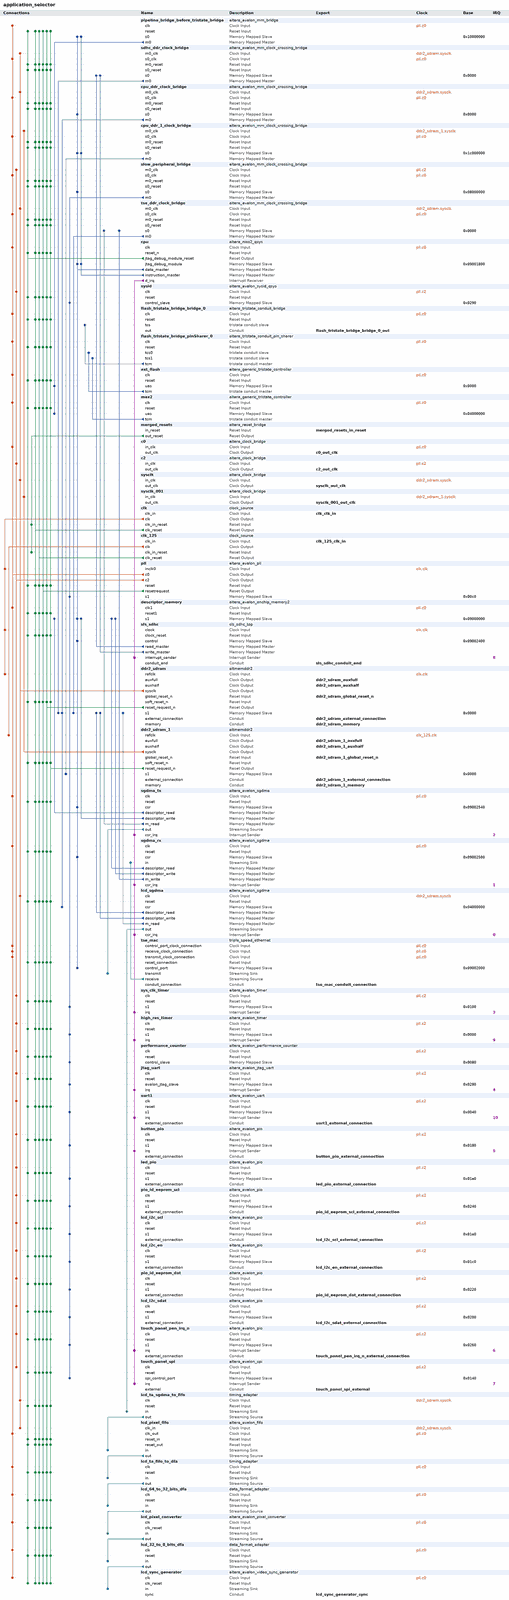
[diagram p0: system contents, whole]
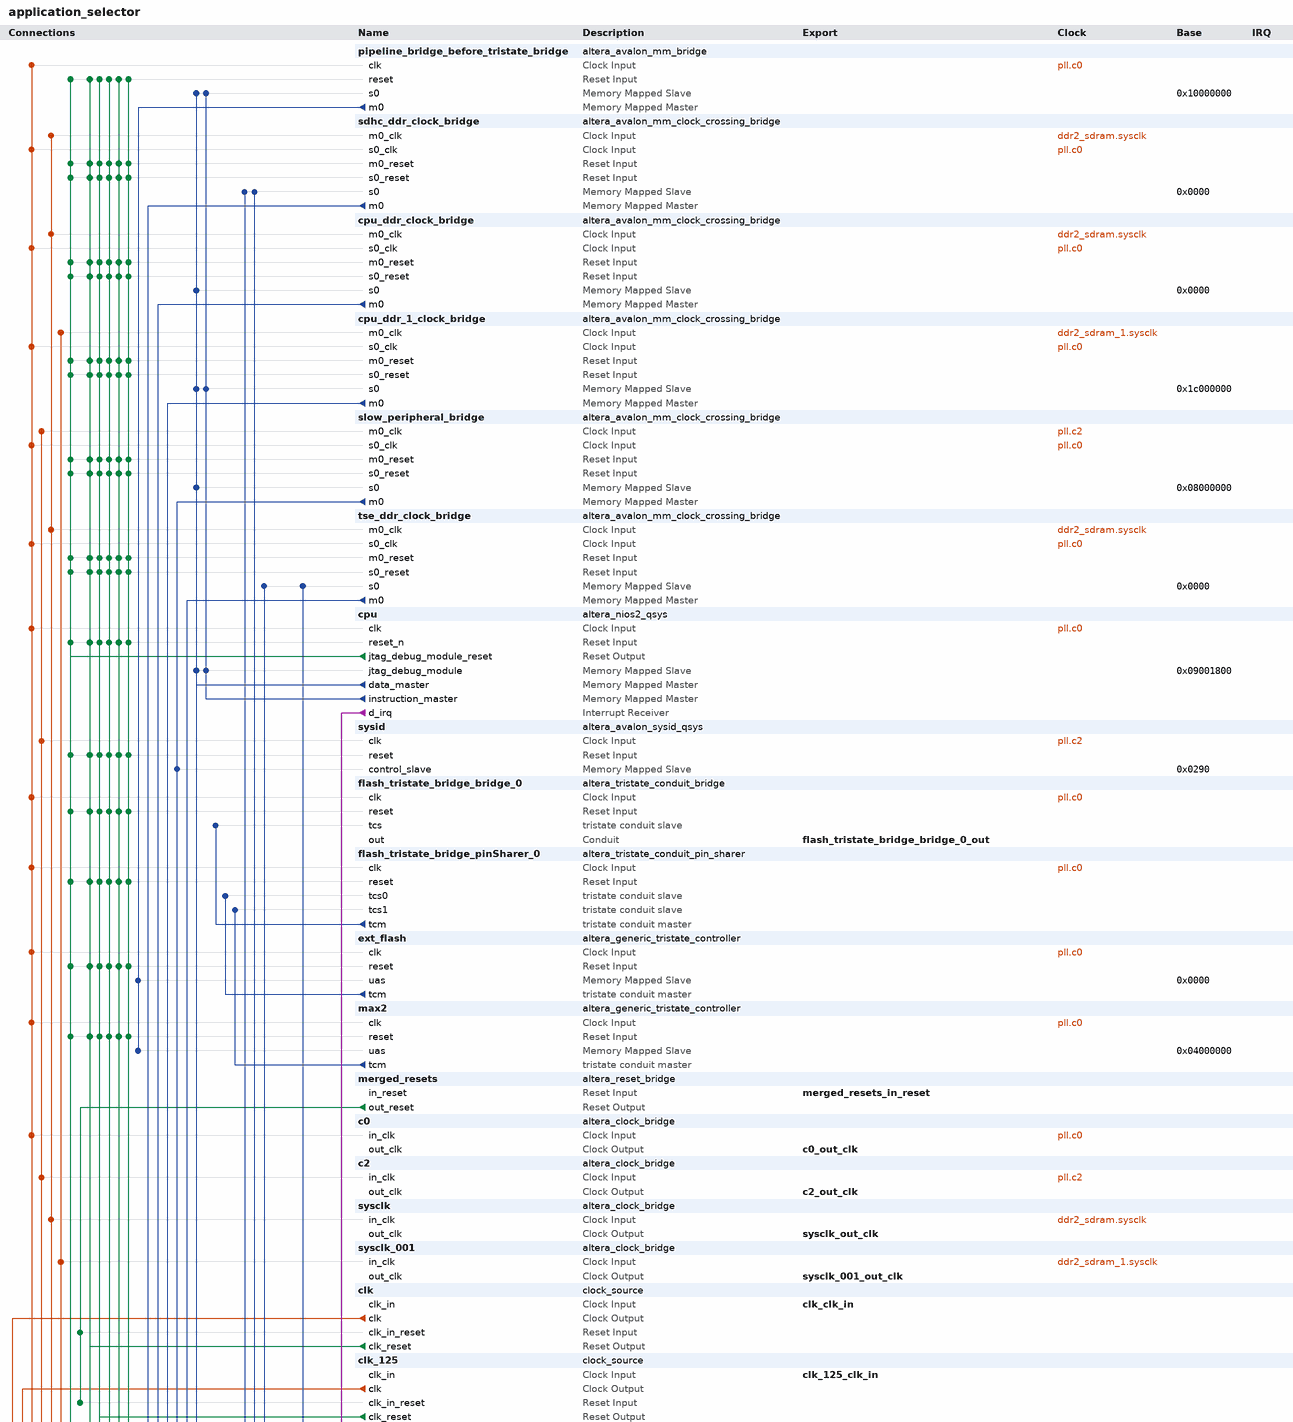
[diagram p1: system contents, upper part]
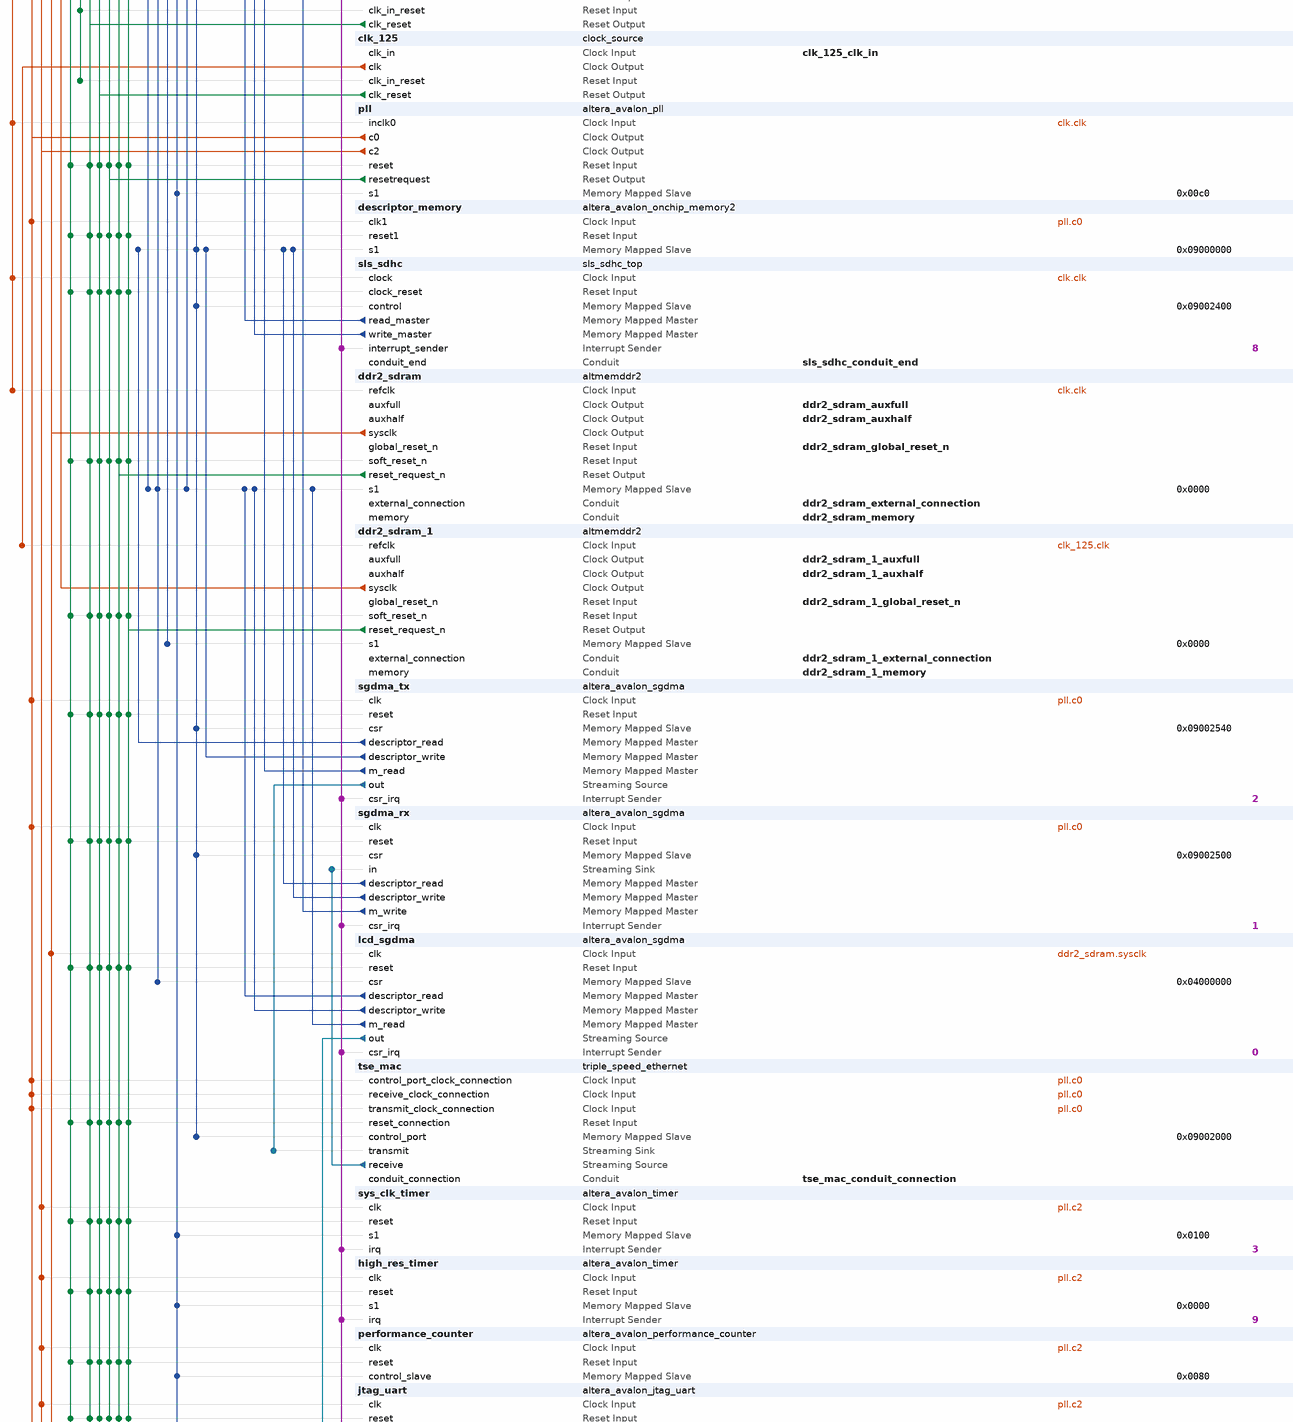
[diagram p2: system contents, middle part]
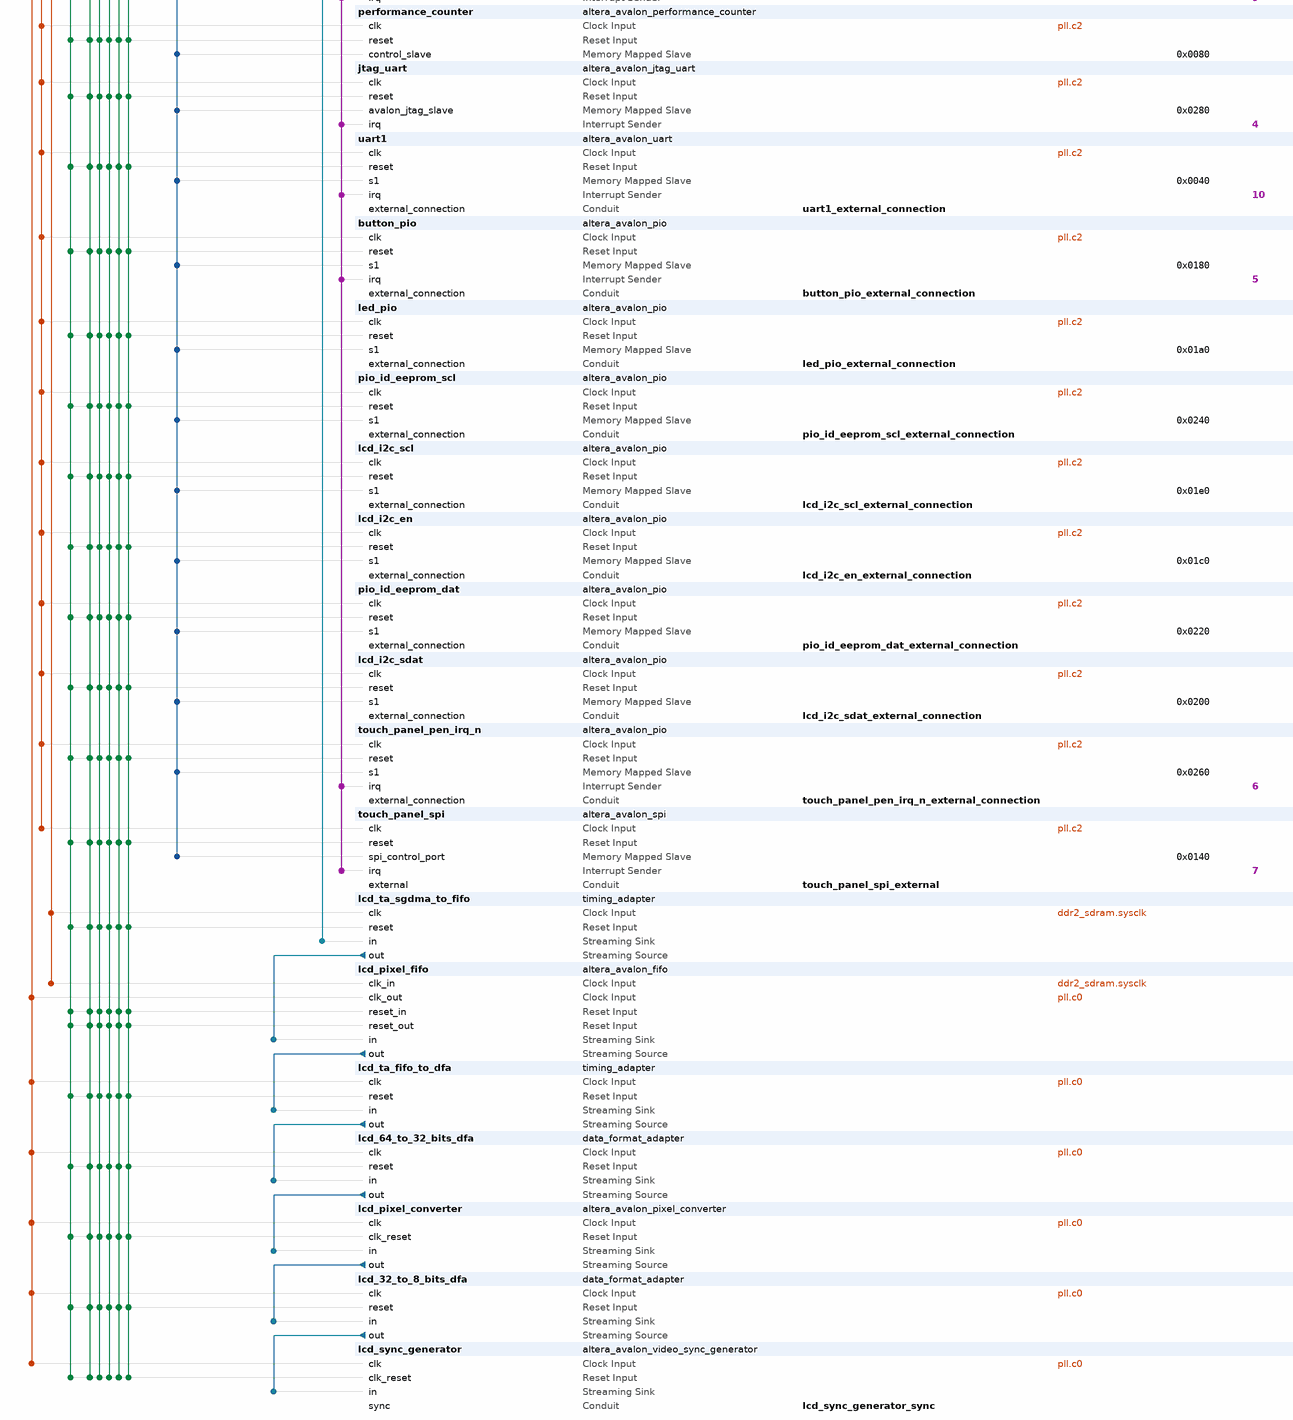
[diagram p3: system contents, lower part]
# Platform Designer (Qsys) system application_selector
# Parameters at their usual value, and those the tool derives, are not listed.
package require -exact qsys 11.0
create_system application_selector
set_project_property DEVICE_FAMILY CYCLONEIII

add_instance pipeline_bridge_before_tristate_bridge altera_avalon_mm_bridge 11.0
set_instance_parameter_value pipeline_bridge_before_tristate_bridge DATA_WIDTH 32
set_instance_parameter_value pipeline_bridge_before_tristate_bridge ADDRESS_WIDTH 27
set_instance_parameter_value pipeline_bridge_before_tristate_bridge ADDRESS_UNITS SYMBOLS
set_instance_parameter_value pipeline_bridge_before_tristate_bridge MAX_PENDING_RESPONSES 5

add_instance sdhc_ddr_clock_bridge altera_avalon_mm_clock_crossing_bridge 11.0
set_instance_parameter_value sdhc_ddr_clock_bridge DATA_WIDTH 64
set_instance_parameter_value sdhc_ddr_clock_bridge ADDRESS_WIDTH 26
set_instance_parameter_value sdhc_ddr_clock_bridge MAX_BURST_SIZE 1
set_instance_parameter_value sdhc_ddr_clock_bridge COMMAND_FIFO_DEPTH 8
set_instance_parameter_value sdhc_ddr_clock_bridge RESPONSE_FIFO_DEPTH 64
set_instance_parameter_value sdhc_ddr_clock_bridge MASTER_SYNC_DEPTH 3
set_instance_parameter_value sdhc_ddr_clock_bridge SLAVE_SYNC_DEPTH 3

add_instance cpu_ddr_clock_bridge altera_avalon_mm_clock_crossing_bridge 11.0
set_instance_parameter_value cpu_ddr_clock_bridge DATA_WIDTH 32
set_instance_parameter_value cpu_ddr_clock_bridge ADDRESS_WIDTH 27
set_instance_parameter_value cpu_ddr_clock_bridge MAX_BURST_SIZE 1
set_instance_parameter_value cpu_ddr_clock_bridge COMMAND_FIFO_DEPTH 8
set_instance_parameter_value cpu_ddr_clock_bridge RESPONSE_FIFO_DEPTH 64
set_instance_parameter_value cpu_ddr_clock_bridge MASTER_SYNC_DEPTH 3
set_instance_parameter_value cpu_ddr_clock_bridge SLAVE_SYNC_DEPTH 3

add_instance cpu_ddr_1_clock_bridge altera_avalon_mm_clock_crossing_bridge 11.0
set_instance_parameter_value cpu_ddr_1_clock_bridge DATA_WIDTH 32
set_instance_parameter_value cpu_ddr_1_clock_bridge ADDRESS_WIDTH 26
set_instance_parameter_value cpu_ddr_1_clock_bridge MAX_BURST_SIZE 1
set_instance_parameter_value cpu_ddr_1_clock_bridge COMMAND_FIFO_DEPTH 8
set_instance_parameter_value cpu_ddr_1_clock_bridge RESPONSE_FIFO_DEPTH 64
set_instance_parameter_value cpu_ddr_1_clock_bridge MASTER_SYNC_DEPTH 3
set_instance_parameter_value cpu_ddr_1_clock_bridge SLAVE_SYNC_DEPTH 3

add_instance slow_peripheral_bridge altera_avalon_mm_clock_crossing_bridge 11.0
set_instance_parameter_value slow_peripheral_bridge DATA_WIDTH 32
set_instance_parameter_value slow_peripheral_bridge ADDRESS_WIDTH 10
set_instance_parameter_value slow_peripheral_bridge MAX_BURST_SIZE 1
set_instance_parameter_value slow_peripheral_bridge COMMAND_FIFO_DEPTH 16
set_instance_parameter_value slow_peripheral_bridge RESPONSE_FIFO_DEPTH 64
set_instance_parameter_value slow_peripheral_bridge MASTER_SYNC_DEPTH 3
set_instance_parameter_value slow_peripheral_bridge SLAVE_SYNC_DEPTH 3

add_instance tse_ddr_clock_bridge altera_avalon_mm_clock_crossing_bridge 11.0
set_instance_parameter_value tse_ddr_clock_bridge DATA_WIDTH 32
set_instance_parameter_value tse_ddr_clock_bridge ADDRESS_WIDTH 26
set_instance_parameter_value tse_ddr_clock_bridge MAX_BURST_SIZE 1
set_instance_parameter_value tse_ddr_clock_bridge COMMAND_FIFO_DEPTH 8
set_instance_parameter_value tse_ddr_clock_bridge RESPONSE_FIFO_DEPTH 64
set_instance_parameter_value tse_ddr_clock_bridge MASTER_SYNC_DEPTH 3
set_instance_parameter_value tse_ddr_clock_bridge SLAVE_SYNC_DEPTH 3

add_instance cpu altera_nios2_qsys 11.0
set_instance_parameter_value cpu manuallyAssignCpuID false
set_instance_parameter_value cpu resetOffset 1048576
set_instance_parameter_value cpu exceptionOffset 64
set_instance_parameter_value cpu resetSlave ext_flash.uas
set_instance_parameter_value cpu exceptionSlave ddr2_sdram_1.s1
set_instance_parameter_value cpu breakSlave cpu.jtag_debug_module
set_instance_parameter_value cpu impl Fast
set_instance_parameter_value cpu icache_size 32768
set_instance_parameter_value cpu dcache_size 32768

add_instance sysid altera_avalon_sysid_qsys 11.0
set_instance_parameter_value sysid id 0

add_instance flash_tristate_bridge_bridge_0 altera_tristate_conduit_bridge 11.0

add_instance flash_tristate_bridge_pinSharer_0 altera_tristate_conduit_pin_sharer 11.0
set_instance_parameter_value flash_tristate_bridge_pinSharer_0 NUM_INTERFACES 2
set_instance_parameter_value flash_tristate_bridge_pinSharer_0 MODULE_ORIGIN_LIST max2.tcm,max2.tcm,max2.tcm,max2.tcm,max2.tcm,ext_flash.tcm,ext_flash.tcm,ext_flash.tcm,ext_flash.tcm,ext_flash.tcm
set_instance_parameter_value flash_tristate_bridge_pinSharer_0 SIGNAL_ORIGIN_LIST address,read_n,write_n,data,chipselect_n,address,read_n,write_n,data,chipselect_n
set_instance_parameter_value flash_tristate_bridge_pinSharer_0 SHARED_SIGNAL_LIST flash_tristate_bridge_address,oe_n_to_the_max2,we_n_to_the_max2,flash_tristate_bridge_data,cs_n_to_the_max2,flash_tristate_bridge_address,read_n_to_the_ext_flash,write_n_to_the_ext_flash,flash_tristate_bridge_data,select_n_to_the_ext_flash

add_instance ext_flash altera_generic_tristate_controller 11.0
set_instance_parameter_value ext_flash TCM_ADDRESS_W 26
set_instance_parameter_value ext_flash TCM_DATA_W 16
set_instance_parameter_value ext_flash TCM_BYTEENABLE_W 2
set_instance_parameter_value ext_flash TCM_READ_WAIT 40
set_instance_parameter_value ext_flash TCM_WRITE_WAIT 40
set_instance_parameter_value ext_flash TCM_SETUP_WAIT 80
set_instance_parameter_value ext_flash TCM_DATA_HOLD 20
set_instance_parameter_value ext_flash TCM_MAX_PENDING_READ_TRANSACTIONS 3
set_instance_parameter_value ext_flash TCM_TURNAROUND_TIME 2
set_instance_parameter_value ext_flash TCM_TIMING_UNITS 0
set_instance_parameter_value ext_flash TCM_READLATENCY 2
set_instance_parameter_value ext_flash TCM_SYMBOLS_PER_WORD 2
set_instance_parameter_value ext_flash USE_READ 1
set_instance_parameter_value ext_flash USE_BEGINTRANSFER 0
set_instance_parameter_value ext_flash USE_BYTEENABLE 0
set_instance_parameter_value ext_flash USE_OUTPUTENABLE 0
set_instance_parameter_value ext_flash ACTIVE_LOW_READ 1
set_instance_parameter_value ext_flash ACTIVE_LOW_BYTEENABLE 0
set_instance_parameter_value ext_flash ACTIVE_LOW_OUTPUTENABLE 0
set_instance_parameter_value ext_flash ACTIVE_LOW_BEGINTRANSFER 0
set_instance_parameter_value ext_flash CHIPSELECT_THROUGH_READLATENCY 0
set_instance_parameter_value ext_flash MODULE_ASSIGNMENT_KEYS embeddedsw.configuration.hwClassnameDriverSupportList,embeddedsw.configuration.hwClassnameDriverSupportDefault,embeddedsw.CMacro.SETUP_VALUE,embeddedsw.CMacro.WAIT_VALUE,embeddedsw.CMacro.HOLD_VALUE,embeddedsw.CMacro.TIMING_UNITS,embeddedsw.CMacro.SIZE,embeddedsw.memoryInfo.MEM_INIT_DATA_WIDTH,embeddedsw.memoryInfo.HAS_BYTE_LANE,embeddedsw.memoryInfo.IS_FLASH,embeddedsw.memoryInfo.GENERATE_DAT_SYM,embeddedsw.memoryInfo.GENERATE_FLASH,embeddedsw.memoryInfo.DAT_SYM_INSTALL_DIR,embeddedsw.memoryInfo.FLASH_INSTALL_DIR
set_instance_parameter_value ext_flash MODULE_ASSIGNMENT_VALUES {altera_avalon_lan91c111:altera_avalon_cfi_flash,altera_avalon_cfi_flash,80,40,20,"ns",67108864u,16,1,1,1,1,SIM_DIR,APP_DIR}
set_instance_parameter_value ext_flash INTERFACE_ASSIGNMENT_KEYS embeddedsw.configuration.isFlash,embeddedsw.configuration.isMemoryDevice,embeddedsw.configuration.isNonVolatileStorage
set_instance_parameter_value ext_flash INTERFACE_ASSIGNMENT_VALUES 1,1,1

add_instance max2 altera_generic_tristate_controller 11.0
set_instance_parameter_value max2 TCM_ADDRESS_W 5
set_instance_parameter_value max2 TCM_DATA_W 32
set_instance_parameter_value max2 TCM_BYTEENABLE_W 4
set_instance_parameter_value max2 TCM_READ_WAIT 100
set_instance_parameter_value max2 TCM_WRITE_WAIT 100
set_instance_parameter_value max2 TCM_SETUP_WAIT 0
set_instance_parameter_value max2 TCM_DATA_HOLD 0
set_instance_parameter_value max2 TCM_MAX_PENDING_READ_TRANSACTIONS 3
set_instance_parameter_value max2 TCM_TURNAROUND_TIME 2
set_instance_parameter_value max2 TCM_TIMING_UNITS 0
set_instance_parameter_value max2 TCM_READLATENCY 2
set_instance_parameter_value max2 TCM_SYMBOLS_PER_WORD 4
set_instance_parameter_value max2 USE_READ 1
set_instance_parameter_value max2 USE_BEGINTRANSFER 0
set_instance_parameter_value max2 USE_BYTEENABLE 0
set_instance_parameter_value max2 USE_OUTPUTENABLE 0
set_instance_parameter_value max2 ACTIVE_LOW_READ 1
set_instance_parameter_value max2 ACTIVE_LOW_BYTEENABLE 0
set_instance_parameter_value max2 ACTIVE_LOW_OUTPUTENABLE 0
set_instance_parameter_value max2 ACTIVE_LOW_BEGINTRANSFER 0
set_instance_parameter_value max2 CHIPSELECT_THROUGH_READLATENCY 0
set_instance_parameter_value max2 IS_MEMORY_DEVICE 0
set_instance_parameter_value max2 MODULE_ASSIGNMENT_KEYS embeddedsw.configuration.hwClassnameDriverSupportList,embeddedsw.configuration.hwClassnameDriverSupportDefault
set_instance_parameter_value max2 MODULE_ASSIGNMENT_VALUES altera_avalon_lan91c111:altera_avalon_cfi_flash,cycloneIII_3c120_devkit_maxII_interface
set_instance_parameter_value max2 INTERFACE_ASSIGNMENT_KEYS embeddedsw.configuration.isFlash,embeddedsw.configuration.isMemoryDevice,embeddedsw.configuration.isNonVolatileStorage,embeddedsw.configuration.isPrintableDevice
set_instance_parameter_value max2 INTERFACE_ASSIGNMENT_VALUES 0,0,0,0

add_instance merged_resets altera_reset_bridge 11.0
set_instance_parameter_value merged_resets ACTIVE_LOW_RESET 1
set_instance_parameter_value merged_resets SYNCHRONOUS_EDGES none

add_instance c0 altera_clock_bridge 11.0
set_instance_parameter_value c0 DERIVED_CLOCK_RATE 100000000
set_instance_parameter_value c0 EXPLICIT_CLOCK_RATE 0

add_instance c2 altera_clock_bridge 11.0
set_instance_parameter_value c2 DERIVED_CLOCK_RATE 60000000
set_instance_parameter_value c2 EXPLICIT_CLOCK_RATE 0

add_instance sysclk altera_clock_bridge 11.0
set_instance_parameter_value sysclk DERIVED_CLOCK_RATE 76925000
set_instance_parameter_value sysclk EXPLICIT_CLOCK_RATE 0

add_instance sysclk_001 altera_clock_bridge 11.0
set_instance_parameter_value sysclk_001 DERIVED_CLOCK_RATE 153850000
set_instance_parameter_value sysclk_001 EXPLICIT_CLOCK_RATE 0

add_instance clk clock_source 11.0
set_instance_parameter_value clk clockFrequency 50000000

add_instance clk_125 clock_source 11.0
set_instance_parameter_value clk_125 clockFrequency 125000000

add_instance pll altera_avalon_pll 11.0
set_instance_parameter_value pll c0 {tap c0 mult 2 div 1 phase 0 enabled true inputfreq 50000000 outputfreq 100000000}
set_instance_parameter_value pll c1 {tap c1 mult 2 div 1 phase -2000 enabled false inputfreq 50000000 outputfreq 100000000}
set_instance_parameter_value pll c2 {tap c2 mult 6 div 5 phase 0 enabled true inputfreq 50000000 outputfreq 60000000}
set_instance_parameter_value pll c3 {tap c3 mult 4 div 5 phase 0 enabled false inputfreq 50000000 outputfreq 40000000}
set_instance_parameter_value pll c4 {tap c4 mult 1 div 1 phase 0 enabled false inputfreq 0 outputfreq 0}
set_instance_parameter_value pll c5 {tap c5 mult 1 div 1 phase 0 enabled false inputfreq 0 outputfreq 0}
set_instance_parameter_value pll c6 {tap c6 mult 1 div 1 phase 0 enabled false inputfreq 0 outputfreq 0}
set_instance_parameter_value pll c7 {tap c7 mult 1 div 1 phase 0 enabled false inputfreq 0 outputfreq 0}
set_instance_parameter_value pll c8 {tap c8 mult 1 div 1 phase 0 enabled false inputfreq 0 outputfreq 0}
set_instance_parameter_value pll c9 {tap c9 mult 1 div 1 phase 0 enabled false inputfreq 0 outputfreq 0}
set_instance_parameter_value pll e0 {tap e0 mult 1 div 1 phase 0 enabled false inputfreq 0 outputfreq 0}
set_instance_parameter_value pll e1 {tap e1 mult 1 div 1 phase 0 enabled false inputfreq 0 outputfreq 0}
set_instance_parameter_value pll e2 {tap e2 mult 1 div 1 phase 0 enabled false inputfreq 0 outputfreq 0}
set_instance_parameter_value pll e3 {tap e3 mult 1 div 1 phase 0 enabled false inputfreq 0 outputfreq 0}
set_instance_parameter_value pll inputClockRate 50000000
set_instance_parameter_value pll lockedOutputPortOption Export
set_instance_parameter_value pll pfdenaInputPortOption Register
set_instance_parameter_value pll resetInputPortOption Register

add_instance descriptor_memory altera_avalon_onchip_memory2 11.0
set_instance_parameter_value descriptor_memory dataWidth 32
set_instance_parameter_value descriptor_memory dualPort false
set_instance_parameter_value descriptor_memory initMemContent true
set_instance_parameter_value descriptor_memory initializationFileName descriptor_memory
set_instance_parameter_value descriptor_memory memorySize 4096

add_instance sls_sdhc sls_sdhc_top 2.7
set_instance_parameter_value sls_sdhc tx_buffer_depth 2048
set_instance_parameter_value sls_sdhc rx_buffer_depth 2048

add_instance ddr2_sdram altmemddr2 11.0
set_instance_parameter_value ddr2_sdram pipeline_commands false
set_instance_parameter_value ddr2_sdram debug_en false
set_instance_parameter_value ddr2_sdram export_debug_port false
set_instance_parameter_value ddr2_sdram use_generated_memory_model true
set_instance_parameter_value ddr2_sdram dedicated_memory_clk_phase_label {Dedicated memory clock phase:}
set_instance_parameter_value ddr2_sdram mem_if_clk_mhz 153.85
set_instance_parameter_value ddr2_sdram quartus_project_exists false
set_instance_parameter_value ddr2_sdram local_if_drate HALF
set_instance_parameter_value ddr2_sdram enable_v72_rsu false
set_instance_parameter_value ddr2_sdram local_if_clk_mhz_label 76.9
set_instance_parameter_value ddr2_sdram new_variant true
set_instance_parameter_value ddr2_sdram mem_if_memtype {DDR2 SDRAM}
set_instance_parameter_value ddr2_sdram pll_ref_clk_mhz 50.0
set_instance_parameter_value ddr2_sdram mem_if_clk_ps_label {(6500 ps)}
set_instance_parameter_value ddr2_sdram family {Cyclone III}
set_instance_parameter_value ddr2_sdram project_family {Cyclone III}
set_instance_parameter_value ddr2_sdram speed_grade 7
set_instance_parameter_value ddr2_sdram dedicated_memory_clk_phase 0
set_instance_parameter_value ddr2_sdram pll_ref_clk_ps_label {(20000 ps)}
set_instance_parameter_value ddr2_sdram avalon_burst_length 1
set_instance_parameter_value ddr2_sdram mem_if_clk_pair_count 1
set_instance_parameter_value ddr2_sdram mem_if_cs_per_dimm 1
set_instance_parameter_value ddr2_sdram pre_latency_label {Fix read latency at:}
set_instance_parameter_value ddr2_sdram dedicated_memory_clk_en false
set_instance_parameter_value ddr2_sdram mirror_addressing 0
set_instance_parameter_value ddr2_sdram mem_if_bankaddr_width 2
set_instance_parameter_value ddr2_sdram register_control_word_9 0000
set_instance_parameter_value ddr2_sdram mem_if_rowaddr_width 13
set_instance_parameter_value ddr2_sdram mem_dyn_deskew_en false
set_instance_parameter_value ddr2_sdram post_latency_label {cycles (0 cycles=minimum latency, non-deterministic)}
set_instance_parameter_value ddr2_sdram mem_if_dm_pins_en Yes
set_instance_parameter_value ddr2_sdram local_if_dwidth_label 64
set_instance_parameter_value ddr2_sdram register_control_word_7 0000
set_instance_parameter_value ddr2_sdram register_control_word_8 0000
set_instance_parameter_value ddr2_sdram mem_if_preset {Micron MT47H32M16CC-3}
set_instance_parameter_value ddr2_sdram mem_if_pchaddr_bit 10
set_instance_parameter_value ddr2_sdram WIDTH_RATIO 4
set_instance_parameter_value ddr2_sdram vendor Micron
set_instance_parameter_value ddr2_sdram register_control_word_3 0000
set_instance_parameter_value ddr2_sdram register_control_word_4 0000
set_instance_parameter_value ddr2_sdram chip_or_dimm {Discrete Device}
set_instance_parameter_value ddr2_sdram register_control_word_5 0000
set_instance_parameter_value ddr2_sdram register_control_word_6 0000
set_instance_parameter_value ddr2_sdram mem_fmax 333.333
set_instance_parameter_value ddr2_sdram register_control_word_0 0000
set_instance_parameter_value ddr2_sdram register_control_word_size 4
set_instance_parameter_value ddr2_sdram register_control_word_1 0000
set_instance_parameter_value ddr2_sdram register_control_word_2 0000
set_instance_parameter_value ddr2_sdram register_control_word_11 0000
set_instance_parameter_value ddr2_sdram register_control_word_10 0000
set_instance_parameter_value ddr2_sdram mem_if_cs_width 1
set_instance_parameter_value ddr2_sdram mem_if_preset_rlat 0
set_instance_parameter_value ddr2_sdram mem_if_cs_per_rank 1
set_instance_parameter_value ddr2_sdram fast_simulation_en FAST
set_instance_parameter_value ddr2_sdram register_control_word_15 0000
set_instance_parameter_value ddr2_sdram register_control_word_14 0000
set_instance_parameter_value ddr2_sdram mem_if_dwidth 16
set_instance_parameter_value ddr2_sdram mem_if_dq_per_dqs 8
set_instance_parameter_value ddr2_sdram mem_if_coladdr_width 10
set_instance_parameter_value ddr2_sdram register_control_word_13 0000
set_instance_parameter_value ddr2_sdram register_control_word_12 0000
set_instance_parameter_value ddr2_sdram mem_tiha_ps 400
set_instance_parameter_value ddr2_sdram mem_tdsh_ck 0.2
set_instance_parameter_value ddr2_sdram mem_if_trfc_ns 105.0
set_instance_parameter_value ddr2_sdram mem_tqh_ck 0.36
set_instance_parameter_value ddr2_sdram mem_tisa_ps 400
set_instance_parameter_value ddr2_sdram mem_tdss_ck 0.2
set_instance_parameter_value ddr2_sdram mem_trtp_ns 0.0
set_instance_parameter_value ddr2_sdram mem_if_tinit_us 200.0
set_instance_parameter_value ddr2_sdram mem_if_trcd_ns 15.0
set_instance_parameter_value ddr2_sdram mem_if_twtr_ck 3
set_instance_parameter_value ddr2_sdram mem_trrd_ns 0.0
set_instance_parameter_value ddr2_sdram mem_tdqss_ck 0.25
set_instance_parameter_value ddr2_sdram mem_tqhs_ps 340
set_instance_parameter_value ddr2_sdram mem_tdsa_ps 300
set_instance_parameter_value ddr2_sdram mem_tac_ps 450
set_instance_parameter_value ddr2_sdram mem_tdha_ps 300
set_instance_parameter_value ddr2_sdram mem_if_tras_ns 40.0
set_instance_parameter_value ddr2_sdram mem_if_twr_ns 15.0
set_instance_parameter_value ddr2_sdram mem_tdqsck_ps 400
set_instance_parameter_value ddr2_sdram mem_if_trp_ns 15.0
set_instance_parameter_value ddr2_sdram mem_tdqsq_ps 240
set_instance_parameter_value ddr2_sdram mem_if_tmrd_ns 6.0
set_instance_parameter_value ddr2_sdram mem_tfaw_ns 0.0
set_instance_parameter_value ddr2_sdram mem_if_trefi_us 7.8
set_instance_parameter_value ddr2_sdram mem_tcl_40_fmax 333.333
set_instance_parameter_value ddr2_sdram mem_odt 50
set_instance_parameter_value ddr2_sdram mp_WLH_percent 0.6
set_instance_parameter_value ddr2_sdram mem_drv_str Normal
set_instance_parameter_value ddr2_sdram mp_DH_percent 0.5
set_instance_parameter_value ddr2_sdram input_period 0
set_instance_parameter_value ddr2_sdram mp_QH_percent 0.5
set_instance_parameter_value ddr2_sdram mp_QHS_percent 0.5
set_instance_parameter_value ddr2_sdram mem_tcl_30_fmax 333.333
set_instance_parameter_value ddr2_sdram ac_clk_select 90
set_instance_parameter_value ddr2_sdram mp_DQSQ_percent 0.65
set_instance_parameter_value ddr2_sdram mp_DS_percent 0.6
set_instance_parameter_value ddr2_sdram pll_reconfig_ports_en false
set_instance_parameter_value ddr2_sdram mem_btype Sequential
set_instance_parameter_value ddr2_sdram mp_IS_percent 0.7
set_instance_parameter_value ddr2_sdram mem_tcl 5.0
set_instance_parameter_value ddr2_sdram mp_DQSS_percent 0.5
set_instance_parameter_value ddr2_sdram export_bank_info false
set_instance_parameter_value ddr2_sdram mp_DSS_percent 0.6
set_instance_parameter_value ddr2_sdram mem_dll_en Yes
set_instance_parameter_value ddr2_sdram ac_phase 90
set_instance_parameter_value ddr2_sdram mem_if_oct_en false
set_instance_parameter_value ddr2_sdram mem_tcl_60_fmax 333.333
set_instance_parameter_value ddr2_sdram mp_DSH_percent 0.6
set_instance_parameter_value ddr2_sdram mem_if_dqsn_en false
set_instance_parameter_value ddr2_sdram enable_mp_calibration true
set_instance_parameter_value ddr2_sdram mp_IH_percent 0.6
set_instance_parameter_value ddr2_sdram mem_tcl_15_fmax 533.0
set_instance_parameter_value ddr2_sdram dll_external false
set_instance_parameter_value ddr2_sdram mem_bl 4
set_instance_parameter_value ddr2_sdram mp_WLS_percent 0.7
set_instance_parameter_value ddr2_sdram mem_tcl_50_fmax 333.333
set_instance_parameter_value ddr2_sdram mp_DQSCK_percent 0.5
set_instance_parameter_value ddr2_sdram mem_tcl_25_fmax 533.0
set_instance_parameter_value ddr2_sdram mem_tcl_20_fmax 533.0
set_instance_parameter_value ddr2_sdram cfg_reorder_data true
set_instance_parameter_value ddr2_sdram ctl_ecc_en false
set_instance_parameter_value ddr2_sdram ctl_hrb_en false
set_instance_parameter_value ddr2_sdram ref_clk_source clk
set_instance_parameter_value ddr2_sdram cfg_data_reordering_type INTER_BANK
set_instance_parameter_value ddr2_sdram ctl_powerdn_en false
set_instance_parameter_value ddr2_sdram multicast_wr_en false
set_instance_parameter_value ddr2_sdram auto_powerdn_cycles 0
set_instance_parameter_value ddr2_sdram ctl_self_refresh_en false
set_instance_parameter_value ddr2_sdram cfg_starve_limit 10
set_instance_parameter_value ddr2_sdram ctl_latency 5
set_instance_parameter_value ddr2_sdram tool_context SOPC_BUILDER
set_instance_parameter_value ddr2_sdram mem_addr_mapping CHIP_ROW_BANK_COL
set_instance_parameter_value ddr2_sdram burst_merge_en false
set_instance_parameter_value ddr2_sdram user_refresh_en false
set_instance_parameter_value ddr2_sdram qsys_mode true
set_instance_parameter_value ddr2_sdram clk_source_sharing_en false
set_instance_parameter_value ddr2_sdram ctl_lookahead_depth 4
set_instance_parameter_value ddr2_sdram ctl_autopch_en false
set_instance_parameter_value ddr2_sdram ctl_dynamic_bank_allocation false
set_instance_parameter_value ddr2_sdram ctl_dynamic_bank_num 4
set_instance_parameter_value ddr2_sdram local_if_type_avalon true
set_instance_parameter_value ddr2_sdram csr_en false
set_instance_parameter_value ddr2_sdram ctl_auto_correct_en false
set_instance_parameter_value ddr2_sdram auto_powerdn_en false
set_instance_parameter_value ddr2_sdram phy_if_type_afi true
set_instance_parameter_value ddr2_sdram controller_type hp_ctl
set_instance_parameter_value ddr2_sdram max_local_size 4
set_instance_parameter_value ddr2_sdram mem_srtr Normal
set_instance_parameter_value ddr2_sdram mem_mpr_loc {Predefined Pattern}
set_instance_parameter_value ddr2_sdram dss_tinit_rst_us 200.0
set_instance_parameter_value ddr2_sdram mem_tcl_90_fmax 400.0
set_instance_parameter_value ddr2_sdram mem_rtt_wr {Dynamic ODT off}
set_instance_parameter_value ddr2_sdram mem_tcl_100_fmax 400.0
set_instance_parameter_value ddr2_sdram mem_pasr {Full Array}
set_instance_parameter_value ddr2_sdram mem_asrm {Manual SR Reference (SRT)}
set_instance_parameter_value ddr2_sdram mem_mpr_oper {Predefined Pattern}
set_instance_parameter_value ddr2_sdram mem_tcl_80_fmax 400.0
set_instance_parameter_value ddr2_sdram mem_drv_impedance RZQ/7
set_instance_parameter_value ddr2_sdram mem_rtt_nom {ODT Disabled}
set_instance_parameter_value ddr2_sdram mem_tcl_70_fmax 400.0
set_instance_parameter_value ddr2_sdram mem_wtcl 5.0
set_instance_parameter_value ddr2_sdram mem_dll_pch {Fast Exit}
set_instance_parameter_value ddr2_sdram mem_atcl Disabled
set_instance_parameter_value ddr2_sdram board_settings_valid true
set_instance_parameter_value ddr2_sdram t_IH 0.4
set_instance_parameter_value ddr2_sdram board_intra_DQS_group_skew 0.02
set_instance_parameter_value ddr2_sdram isi_DQS 0.0
set_instance_parameter_value ddr2_sdram addr_cmd_slew_rate 1.0
set_instance_parameter_value ddr2_sdram board_tpd_inter_DIMM 0.05
set_instance_parameter_value ddr2_sdram board_addresscmd_CK_skew 0.0
set_instance_parameter_value ddr2_sdram t_DS_calculated 0.300
set_instance_parameter_value ddr2_sdram isi_addresscmd_hold 0.0
set_instance_parameter_value ddr2_sdram t_IS 0.4
set_instance_parameter_value ddr2_sdram restore_default_toggle false
set_instance_parameter_value ddr2_sdram dqs_dqsn_slew_rate 2.0
set_instance_parameter_value ddr2_sdram dq_slew_rate 1.0
set_instance_parameter_value ddr2_sdram board_inter_DQS_group_skew 0.02
set_instance_parameter_value ddr2_sdram isi_addresscmd_setup 0.0
set_instance_parameter_value ddr2_sdram board_minCK_DQS_skew -0.01
set_instance_parameter_value ddr2_sdram t_IS_calculated 0.400
set_instance_parameter_value ddr2_sdram num_slots_or_devices 1
set_instance_parameter_value ddr2_sdram board_maxCK_DQS_skew 0.01
set_instance_parameter_value ddr2_sdram board_skew_ps 20
set_instance_parameter_value ddr2_sdram t_DH 0.3
set_instance_parameter_value ddr2_sdram ck_ckn_slew_rate 2.0
set_instance_parameter_value ddr2_sdram isi_DQ 0.0
set_instance_parameter_value ddr2_sdram t_IH_calculated 0.400
set_instance_parameter_value ddr2_sdram t_DH_calculated 0.300
set_instance_parameter_value ddr2_sdram t_DS 0.3

add_instance ddr2_sdram_1 altmemddr2 11.0
set_instance_parameter_value ddr2_sdram_1 pipeline_commands false
set_instance_parameter_value ddr2_sdram_1 debug_en false
set_instance_parameter_value ddr2_sdram_1 export_debug_port false
set_instance_parameter_value ddr2_sdram_1 use_generated_memory_model true
set_instance_parameter_value ddr2_sdram_1 dedicated_memory_clk_phase_label {Dedicated memory clock phase:}
set_instance_parameter_value ddr2_sdram_1 mem_if_clk_mhz 153.85
set_instance_parameter_value ddr2_sdram_1 quartus_project_exists false
set_instance_parameter_value ddr2_sdram_1 local_if_drate Full
set_instance_parameter_value ddr2_sdram_1 enable_v72_rsu false
set_instance_parameter_value ddr2_sdram_1 local_if_clk_mhz_label 153.9
set_instance_parameter_value ddr2_sdram_1 new_variant true
set_instance_parameter_value ddr2_sdram_1 mem_if_memtype {DDR2 SDRAM}
set_instance_parameter_value ddr2_sdram_1 pll_ref_clk_mhz 125.0
set_instance_parameter_value ddr2_sdram_1 mem_if_clk_ps_label {(6500 ps)}
set_instance_parameter_value ddr2_sdram_1 family {Cyclone III}
set_instance_parameter_value ddr2_sdram_1 project_family {Cyclone III}
set_instance_parameter_value ddr2_sdram_1 speed_grade 7
set_instance_parameter_value ddr2_sdram_1 dedicated_memory_clk_phase 0
set_instance_parameter_value ddr2_sdram_1 pll_ref_clk_ps_label {(8000 ps)}
set_instance_parameter_value ddr2_sdram_1 avalon_burst_length 1
set_instance_parameter_value ddr2_sdram_1 mem_if_clk_pair_count 1
set_instance_parameter_value ddr2_sdram_1 mem_if_cs_per_dimm 1
set_instance_parameter_value ddr2_sdram_1 pre_latency_label {Fix read latency at:}
set_instance_parameter_value ddr2_sdram_1 dedicated_memory_clk_en false
set_instance_parameter_value ddr2_sdram_1 mirror_addressing 0
set_instance_parameter_value ddr2_sdram_1 mem_if_bankaddr_width 2
set_instance_parameter_value ddr2_sdram_1 register_control_word_9 0000
set_instance_parameter_value ddr2_sdram_1 mem_if_rowaddr_width 13
set_instance_parameter_value ddr2_sdram_1 mem_dyn_deskew_en false
set_instance_parameter_value ddr2_sdram_1 post_latency_label {cycles (0 cycles=minimum latency, non-deterministic)}
set_instance_parameter_value ddr2_sdram_1 mem_if_dm_pins_en Yes
set_instance_parameter_value ddr2_sdram_1 local_if_dwidth_label 32
set_instance_parameter_value ddr2_sdram_1 register_control_word_7 0000
set_instance_parameter_value ddr2_sdram_1 register_control_word_8 0000
set_instance_parameter_value ddr2_sdram_1 mem_if_preset {Micron MT47H32M16CC-3}
set_instance_parameter_value ddr2_sdram_1 mem_if_pchaddr_bit 10
set_instance_parameter_value ddr2_sdram_1 WIDTH_RATIO 4
set_instance_parameter_value ddr2_sdram_1 vendor Micron
set_instance_parameter_value ddr2_sdram_1 register_control_word_3 0000
set_instance_parameter_value ddr2_sdram_1 register_control_word_4 0000
set_instance_parameter_value ddr2_sdram_1 chip_or_dimm {Discrete Device}
set_instance_parameter_value ddr2_sdram_1 register_control_word_5 0000
set_instance_parameter_value ddr2_sdram_1 register_control_word_6 0000
set_instance_parameter_value ddr2_sdram_1 mem_fmax 333.333
set_instance_parameter_value ddr2_sdram_1 register_control_word_0 0000
set_instance_parameter_value ddr2_sdram_1 register_control_word_size 4
set_instance_parameter_value ddr2_sdram_1 register_control_word_1 0000
set_instance_parameter_value ddr2_sdram_1 register_control_word_2 0000
set_instance_parameter_value ddr2_sdram_1 register_control_word_11 0000
set_instance_parameter_value ddr2_sdram_1 register_control_word_10 0000
set_instance_parameter_value ddr2_sdram_1 mem_if_cs_width 1
set_instance_parameter_value ddr2_sdram_1 mem_if_preset_rlat 0
set_instance_parameter_value ddr2_sdram_1 mem_if_cs_per_rank 1
set_instance_parameter_value ddr2_sdram_1 fast_simulation_en FAST
set_instance_parameter_value ddr2_sdram_1 register_control_word_15 0000
set_instance_parameter_value ddr2_sdram_1 register_control_word_14 0000
set_instance_parameter_value ddr2_sdram_1 mem_if_dwidth 16
set_instance_parameter_value ddr2_sdram_1 mem_if_dq_per_dqs 8
set_instance_parameter_value ddr2_sdram_1 mem_if_coladdr_width 10
set_instance_parameter_value ddr2_sdram_1 register_control_word_13 0000
set_instance_parameter_value ddr2_sdram_1 register_control_word_12 0000
set_instance_parameter_value ddr2_sdram_1 mem_tiha_ps 400
set_instance_parameter_value ddr2_sdram_1 mem_tdsh_ck 0.2
set_instance_parameter_value ddr2_sdram_1 mem_if_trfc_ns 105.0
set_instance_parameter_value ddr2_sdram_1 mem_tqh_ck 0.36
set_instance_parameter_value ddr2_sdram_1 mem_tisa_ps 400
set_instance_parameter_value ddr2_sdram_1 mem_tdss_ck 0.2
set_instance_parameter_value ddr2_sdram_1 mem_trtp_ns 0.0
set_instance_parameter_value ddr2_sdram_1 mem_if_tinit_us 200.0
set_instance_parameter_value ddr2_sdram_1 mem_if_trcd_ns 15.0
set_instance_parameter_value ddr2_sdram_1 mem_if_twtr_ck 3
set_instance_parameter_value ddr2_sdram_1 mem_trrd_ns 0.0
set_instance_parameter_value ddr2_sdram_1 mem_tdqss_ck 0.25
set_instance_parameter_value ddr2_sdram_1 mem_tqhs_ps 340
set_instance_parameter_value ddr2_sdram_1 mem_tdsa_ps 300
set_instance_parameter_value ddr2_sdram_1 mem_tac_ps 450
set_instance_parameter_value ddr2_sdram_1 mem_tdha_ps 300
set_instance_parameter_value ddr2_sdram_1 mem_if_tras_ns 40.0
set_instance_parameter_value ddr2_sdram_1 mem_if_twr_ns 15.0
set_instance_parameter_value ddr2_sdram_1 mem_tdqsck_ps 400
set_instance_parameter_value ddr2_sdram_1 mem_if_trp_ns 15.0
set_instance_parameter_value ddr2_sdram_1 mem_tdqsq_ps 240
set_instance_parameter_value ddr2_sdram_1 mem_if_tmrd_ns 6.0
set_instance_parameter_value ddr2_sdram_1 mem_tfaw_ns 0.0
set_instance_parameter_value ddr2_sdram_1 mem_if_trefi_us 7.8
set_instance_parameter_value ddr2_sdram_1 mem_tcl_40_fmax 333.333
set_instance_parameter_value ddr2_sdram_1 mem_odt 50
set_instance_parameter_value ddr2_sdram_1 mp_WLH_percent 0.6
set_instance_parameter_value ddr2_sdram_1 mem_drv_str Normal
set_instance_parameter_value ddr2_sdram_1 mp_DH_percent 0.5
set_instance_parameter_value ddr2_sdram_1 input_period 0
set_instance_parameter_value ddr2_sdram_1 mp_QH_percent 0.5
set_instance_parameter_value ddr2_sdram_1 mp_QHS_percent 0.5
set_instance_parameter_value ddr2_sdram_1 mem_tcl_30_fmax 333.333
set_instance_parameter_value ddr2_sdram_1 ac_clk_select 90
set_instance_parameter_value ddr2_sdram_1 mp_DQSQ_percent 0.65
set_instance_parameter_value ddr2_sdram_1 mp_DS_percent 0.6
set_instance_parameter_value ddr2_sdram_1 pll_reconfig_ports_en false
set_instance_parameter_value ddr2_sdram_1 mem_btype Sequential
set_instance_parameter_value ddr2_sdram_1 mp_IS_percent 0.7
set_instance_parameter_value ddr2_sdram_1 mem_tcl 5.0
set_instance_parameter_value ddr2_sdram_1 mp_DQSS_percent 0.5
set_instance_parameter_value ddr2_sdram_1 export_bank_info false
set_instance_parameter_value ddr2_sdram_1 mp_DSS_percent 0.6
set_instance_parameter_value ddr2_sdram_1 mem_dll_en Yes
set_instance_parameter_value ddr2_sdram_1 ac_phase 90
set_instance_parameter_value ddr2_sdram_1 mem_if_oct_en false
set_instance_parameter_value ddr2_sdram_1 mem_tcl_60_fmax 333.333
set_instance_parameter_value ddr2_sdram_1 mp_DSH_percent 0.6
set_instance_parameter_value ddr2_sdram_1 mem_if_dqsn_en false
set_instance_parameter_value ddr2_sdram_1 enable_mp_calibration true
set_instance_parameter_value ddr2_sdram_1 mp_IH_percent 0.6
set_instance_parameter_value ddr2_sdram_1 mem_tcl_15_fmax 533.0
set_instance_parameter_value ddr2_sdram_1 dll_external false
set_instance_parameter_value ddr2_sdram_1 mem_bl 4
set_instance_parameter_value ddr2_sdram_1 mp_WLS_percent 0.7
set_instance_parameter_value ddr2_sdram_1 mem_tcl_50_fmax 333.333
set_instance_parameter_value ddr2_sdram_1 mp_DQSCK_percent 0.5
set_instance_parameter_value ddr2_sdram_1 mem_tcl_25_fmax 533.0
set_instance_parameter_value ddr2_sdram_1 mem_tcl_20_fmax 533.0
set_instance_parameter_value ddr2_sdram_1 cfg_reorder_data true
set_instance_parameter_value ddr2_sdram_1 ctl_ecc_en false
set_instance_parameter_value ddr2_sdram_1 ctl_hrb_en false
set_instance_parameter_value ddr2_sdram_1 ref_clk_source clk_125
set_instance_parameter_value ddr2_sdram_1 cfg_data_reordering_type INTER_BANK
set_instance_parameter_value ddr2_sdram_1 ctl_powerdn_en false
set_instance_parameter_value ddr2_sdram_1 multicast_wr_en false
set_instance_parameter_value ddr2_sdram_1 auto_powerdn_cycles 0
set_instance_parameter_value ddr2_sdram_1 ctl_self_refresh_en false
set_instance_parameter_value ddr2_sdram_1 cfg_starve_limit 10
set_instance_parameter_value ddr2_sdram_1 ctl_latency 5
set_instance_parameter_value ddr2_sdram_1 tool_context SOPC_BUILDER
set_instance_parameter_value ddr2_sdram_1 mem_addr_mapping CHIP_ROW_BANK_COL
set_instance_parameter_value ddr2_sdram_1 burst_merge_en false
set_instance_parameter_value ddr2_sdram_1 user_refresh_en false
set_instance_parameter_value ddr2_sdram_1 qsys_mode true
set_instance_parameter_value ddr2_sdram_1 clk_source_sharing_en false
set_instance_parameter_value ddr2_sdram_1 ctl_lookahead_depth 4
set_instance_parameter_value ddr2_sdram_1 ctl_autopch_en false
set_instance_parameter_value ddr2_sdram_1 ctl_dynamic_bank_allocation false
set_instance_parameter_value ddr2_sdram_1 ctl_dynamic_bank_num 4
set_instance_parameter_value ddr2_sdram_1 local_if_type_avalon true
set_instance_parameter_value ddr2_sdram_1 csr_en false
set_instance_parameter_value ddr2_sdram_1 ctl_auto_correct_en false
set_instance_parameter_value ddr2_sdram_1 auto_powerdn_en false
set_instance_parameter_value ddr2_sdram_1 phy_if_type_afi true
set_instance_parameter_value ddr2_sdram_1 controller_type hp_ctl
set_instance_parameter_value ddr2_sdram_1 max_local_size 4
set_instance_parameter_value ddr2_sdram_1 mem_srtr Normal
set_instance_parameter_value ddr2_sdram_1 mem_mpr_loc {Predefined Pattern}
set_instance_parameter_value ddr2_sdram_1 dss_tinit_rst_us 200.0
set_instance_parameter_value ddr2_sdram_1 mem_tcl_90_fmax 400.0
set_instance_parameter_value ddr2_sdram_1 mem_rtt_wr {Dynamic ODT off}
set_instance_parameter_value ddr2_sdram_1 mem_tcl_100_fmax 400.0
set_instance_parameter_value ddr2_sdram_1 mem_pasr {Full Array}
set_instance_parameter_value ddr2_sdram_1 mem_asrm {Manual SR Reference (SRT)}
set_instance_parameter_value ddr2_sdram_1 mem_mpr_oper {Predefined Pattern}
set_instance_parameter_value ddr2_sdram_1 mem_tcl_80_fmax 400.0
set_instance_parameter_value ddr2_sdram_1 mem_drv_impedance RZQ/7
set_instance_parameter_value ddr2_sdram_1 mem_rtt_nom {ODT Disabled}
set_instance_parameter_value ddr2_sdram_1 mem_tcl_70_fmax 400.0
set_instance_parameter_value ddr2_sdram_1 mem_wtcl 5.0
set_instance_parameter_value ddr2_sdram_1 mem_dll_pch {Fast Exit}
set_instance_parameter_value ddr2_sdram_1 mem_atcl Disabled
set_instance_parameter_value ddr2_sdram_1 board_settings_valid true
set_instance_parameter_value ddr2_sdram_1 t_IH 0.4
set_instance_parameter_value ddr2_sdram_1 board_intra_DQS_group_skew 0.02
set_instance_parameter_value ddr2_sdram_1 isi_DQS 0.0
set_instance_parameter_value ddr2_sdram_1 addr_cmd_slew_rate 1.0
set_instance_parameter_value ddr2_sdram_1 board_tpd_inter_DIMM 0.05
set_instance_parameter_value ddr2_sdram_1 board_addresscmd_CK_skew 0.0
set_instance_parameter_value ddr2_sdram_1 t_DS_calculated 0.300
set_instance_parameter_value ddr2_sdram_1 isi_addresscmd_hold 0.0
set_instance_parameter_value ddr2_sdram_1 t_IS 0.4
set_instance_parameter_value ddr2_sdram_1 restore_default_toggle false
set_instance_parameter_value ddr2_sdram_1 dqs_dqsn_slew_rate 2.0
set_instance_parameter_value ddr2_sdram_1 dq_slew_rate 1.0
set_instance_parameter_value ddr2_sdram_1 board_inter_DQS_group_skew 0.02
set_instance_parameter_value ddr2_sdram_1 isi_addresscmd_setup 0.0
set_instance_parameter_value ddr2_sdram_1 board_minCK_DQS_skew -0.01
set_instance_parameter_value ddr2_sdram_1 t_IS_calculated 0.400
set_instance_parameter_value ddr2_sdram_1 num_slots_or_devices 1
set_instance_parameter_value ddr2_sdram_1 board_maxCK_DQS_skew 0.01
set_instance_parameter_value ddr2_sdram_1 board_skew_ps 20
set_instance_parameter_value ddr2_sdram_1 t_DH 0.3
set_instance_parameter_value ddr2_sdram_1 ck_ckn_slew_rate 2.0
set_instance_parameter_value ddr2_sdram_1 isi_DQ 0.0
set_instance_parameter_value ddr2_sdram_1 t_IH_calculated 0.400
set_instance_parameter_value ddr2_sdram_1 t_DH_calculated 0.300
set_instance_parameter_value ddr2_sdram_1 t_DS 0.3

add_instance sgdma_tx altera_avalon_sgdma 11.0
set_instance_parameter_value sgdma_tx enableBurstTransfers false
set_instance_parameter_value sgdma_tx enableUnalignedTransfers false
set_instance_parameter_value sgdma_tx readBlockDataWidth 32
set_instance_parameter_value sgdma_tx sinkErrorWidth 0
set_instance_parameter_value sgdma_tx sourceErrorWidth 1
set_instance_parameter_value sgdma_tx transferMode MEMORY_TO_STREAM
set_instance_parameter_value sgdma_tx writeBurstcountWidth 4

add_instance sgdma_rx altera_avalon_sgdma 11.0
set_instance_parameter_value sgdma_rx enableBurstTransfers false
set_instance_parameter_value sgdma_rx enableUnalignedTransfers false
set_instance_parameter_value sgdma_rx readBlockDataWidth 32
set_instance_parameter_value sgdma_rx sinkErrorWidth 6
set_instance_parameter_value sgdma_rx sourceErrorWidth 0
set_instance_parameter_value sgdma_rx transferMode STREAM_TO_MEMORY
set_instance_parameter_value sgdma_rx writeBurstcountWidth 4

add_instance lcd_sgdma altera_avalon_sgdma 11.0
set_instance_parameter_value lcd_sgdma enableBurstTransfers false
set_instance_parameter_value lcd_sgdma enableUnalignedTransfers false
set_instance_parameter_value lcd_sgdma readBlockDataWidth 64
set_instance_parameter_value lcd_sgdma sinkErrorWidth 0
set_instance_parameter_value lcd_sgdma sourceErrorWidth 0
set_instance_parameter_value lcd_sgdma transferMode MEMORY_TO_STREAM
set_instance_parameter_value lcd_sgdma writeBurstcountWidth 4

add_instance tse_mac triple_speed_ethernet 11.0
set_instance_parameter_value tse_mac atlanticSinkClockRate 0
set_instance_parameter_value tse_mac atlanticSinkClockSource unassigned
set_instance_parameter_value tse_mac atlanticSourceClockRate 0
set_instance_parameter_value tse_mac atlanticSourceClockSource unassigned
set_instance_parameter_value tse_mac avalonSlaveClockRate 0
set_instance_parameter_value tse_mac avalonSlaveClockSource unassigned
set_instance_parameter_value tse_mac avalonStNeighbours {unassigned=unassigned}
set_instance_parameter_value tse_mac channel_count 1
set_instance_parameter_value tse_mac core_variation MAC_ONLY
set_instance_parameter_value tse_mac core_version 2816
set_instance_parameter_value tse_mac crc32check16bit 0
set_instance_parameter_value tse_mac crc32dwidth 8
set_instance_parameter_value tse_mac crc32gendelay 6
set_instance_parameter_value tse_mac crc32s1l2_extern false
set_instance_parameter_value tse_mac cust_version 0
set_instance_parameter_value tse_mac dataBitsPerSymbol 8
set_instance_parameter_value tse_mac dev_version 2816
set_instance_parameter_value tse_mac eg_addr 10
set_instance_parameter_value tse_mac ena_hash true
set_instance_parameter_value tse_mac enable_alt_reconfig false
set_instance_parameter_value tse_mac enable_clk_sharing false
set_instance_parameter_value tse_mac enable_ena 32
set_instance_parameter_value tse_mac enable_fifoless false
set_instance_parameter_value tse_mac enable_gmii_loopback true
set_instance_parameter_value tse_mac enable_hd_logic true
set_instance_parameter_value tse_mac enable_mac_flow_ctrl false
set_instance_parameter_value tse_mac enable_mac_txaddr_set true
set_instance_parameter_value tse_mac enable_mac_vlan false
set_instance_parameter_value tse_mac enable_maclite false
set_instance_parameter_value tse_mac enable_magic_detect true
set_instance_parameter_value tse_mac enable_multi_channel false
set_instance_parameter_value tse_mac enable_pkt_class true
set_instance_parameter_value tse_mac enable_pma false
set_instance_parameter_value tse_mac enable_reg_sharing false
set_instance_parameter_value tse_mac enable_sgmii false
set_instance_parameter_value tse_mac enable_shift16 true
set_instance_parameter_value tse_mac enable_sup_addr true
set_instance_parameter_value tse_mac enable_use_internal_fifo true
set_instance_parameter_value tse_mac export_calblkclk false
set_instance_parameter_value tse_mac export_pwrdn false
set_instance_parameter_value tse_mac ext_stat_cnt_ena false
set_instance_parameter_value tse_mac gigeAdvanceMode false
set_instance_parameter_value tse_mac ifGMII MII_GMII
set_instance_parameter_value tse_mac ifPCSuseEmbeddedSerdes false
set_instance_parameter_value tse_mac ing_addr 10
set_instance_parameter_value tse_mac insert_ta true
set_instance_parameter_value tse_mac maclite_gige false
set_instance_parameter_value tse_mac max_channels 1
set_instance_parameter_value tse_mac mdio_clk_div 40
set_instance_parameter_value tse_mac phy_identifier 0
set_instance_parameter_value tse_mac ramType AUTO
set_instance_parameter_value tse_mac reset_level 1
set_instance_parameter_value tse_mac starting_channel_number 0
set_instance_parameter_value tse_mac stat_cnt_ena true
set_instance_parameter_value tse_mac timingAdapterName timingAdapter
set_instance_parameter_value tse_mac toolContext SOPC_BUILDER
set_instance_parameter_value tse_mac transceiver_type GXB
set_instance_parameter_value tse_mac uiHostClockFrequency 0
set_instance_parameter_value tse_mac uiMDIOFreq {0.0 MHz}
set_instance_parameter_value tse_mac useLvds false
set_instance_parameter_value tse_mac useMAC true
set_instance_parameter_value tse_mac useMDIO true
set_instance_parameter_value tse_mac usePCS false
set_instance_parameter_value tse_mac use_sync_reset true

add_instance sys_clk_timer altera_avalon_timer 11.0
set_instance_parameter_value sys_clk_timer period 10.0
set_instance_parameter_value sys_clk_timer periodUnits MSEC
set_instance_parameter_value sys_clk_timer timerPreset FULL_FEATURED
